# Altium schematic sheet HDMI.SchDoc
size A; SheetNumber: 8; SheetTotal: 10
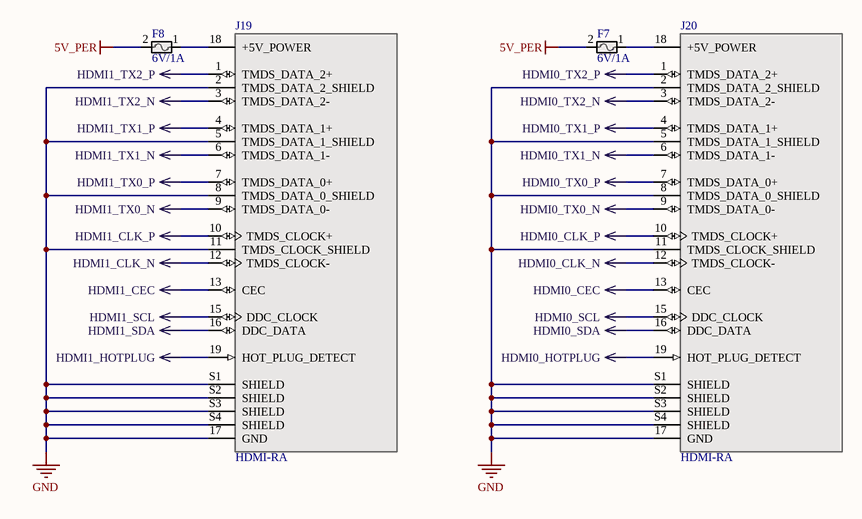
[diagram p0: HDMI.SchDoc]

## Parts
F7  6V/1A  [0805]
F8  6V/1A  [0805]
J19  HDMI-RA  [CUI_HD01-19-RA-TH]
J20  HDMI-RA  [CUI_HD01-19-RA-TH]

## Nets
5V_PER: F7.2 F8.2
GND: J19.2(TMDS_DATA_2_SHIELD) J19.5(TMDS_DATA_1_SHIELD) J19.8(TMDS_DATA_0_SHIELD) J19.11(TMDS_CLOCK_SHIELD) J19.17(GND) J19.S1(SHIELD) J19.S2(SHIELD) J19.S3(SHIELD) J19.S4(SHIELD) J20.2(TMDS_DATA_2_SHIELD) J20.5(TMDS_DATA_1_SHIELD) J20.8(TMDS_DATA_0_SHIELD) J20.11(TMDS_CLOCK_SHIELD) J20.17(GND) J20.S1(SHIELD) J20.S2(SHIELD) J20.S3(SHIELD) J20.S4(SHIELD)
HDMI0_CEC: J20.13(CEC)
HDMI0_CLK_N: J20.12(TMDS_CLOCK-)
HDMI0_CLK_P: J20.10(TMDS_CLOCK+)
HDMI0_HOTPLUG: J20.19(HOT_PLUG_DETECT)
HDMI0_SCL: J20.15(DDC_CLOCK)
HDMI0_SDA: J20.16(DDC_DATA)
HDMI0_TX0_N: J20.9(TMDS_DATA_0-)
HDMI0_TX0_P: J20.7(TMDS_DATA_0+)
HDMI0_TX1_N: J20.6(TMDS_DATA_1-)
HDMI0_TX1_P: J20.4(TMDS_DATA_1+)
HDMI0_TX2_N: J20.3(TMDS_DATA_2-)
HDMI0_TX2_P: J20.1(TMDS_DATA_2+)
HDMI1_CEC: J19.13(CEC)
HDMI1_CLK_N: J19.12(TMDS_CLOCK-)
HDMI1_CLK_P: J19.10(TMDS_CLOCK+)
HDMI1_HOTPLUG: J19.19(HOT_PLUG_DETECT)
HDMI1_SCL: J19.15(DDC_CLOCK)
HDMI1_SDA: J19.16(DDC_DATA)
HDMI1_TX0_N: J19.9(TMDS_DATA_0-)
HDMI1_TX0_P: J19.7(TMDS_DATA_0+)
HDMI1_TX1_N: J19.6(TMDS_DATA_1-)
HDMI1_TX1_P: J19.4(TMDS_DATA_1+)
HDMI1_TX2_N: J19.3(TMDS_DATA_2-)
HDMI1_TX2_P: J19.1(TMDS_DATA_2+)
NetF7_1: F7.1 J20.18(+5V_POWER)
NetF8_1: F8.1 J19.18(+5V_POWER)

## Notes on the sheet
- REV
- REVISIONS
- DATE
- DESCRIPTION
- BY
- UNLESS OTHERWISE SPECIFIED, DRAWING DEFINITIONS AND TOLERANCES SHALL BE FOUND UNDER SUPPLIER STANDARDS SS-001. THIS PART AND ALL COMPONENTS OF IT MUST BE RoHS & REACH COMPLIANT. A CERTIFICATE OF COMPLIANCE MUST BE PROVIDED UPON REQUEST.
- ALL INFORMATION ON THIS DOCUMENT IS THE SOLE PROPERTY OF GAMBER-JOHNSON AND SHALL NOT BE COPIED, REPRODUCED, USED OR DISCLOSED IN WHOLE OR IN PART WITHOUT THE WRITTEN CONSENT OF GAMBER-JOHNSON
- TOLERANCES
  .00 ± .060
  .000 ± .020
  .0000 ± .005
  ANGELS ± 1°
- DRAWN BY:
- PROJECT NUMBER:
- SHEET TITLE:
- SHEET
- OF
- DATE:
- LOCATION:
- ASSEMBLY NUMBER
- SIZE
- GAMBER-JOHNSON LLC
  5001 Joerns Dr
  STEVENS POINT, WI 54481
  +1 (715) 344-5209
- A

## Library data of the parts
F7 F8 = 0ZCK0100FF2E: Polymeric PTC Resettable Fuse 6V 1 A Ih Surface Mount 0805 (2012 Metric), Concave; Manufacturer: Bel; Max Current Rating: 40A; Hold Current: 1A; Trip Current: 1.95A; Time to Trip: 0.3s; Supplier 1: Digi-Key; Supplier Part Number 1: 507-1815-1-ND; Manufacturer Part Number: 0ZCK0100FF2E; RoHS: Yes; Category: PTC Resettable Fuses; Stock 1: 74738; Pricing 1: 1=0.27000, 5=0.26600, 10=0.25400, 50=0.22620, 100=0.21060, 250=0.18720, 500=0.15600, 1000=0.14820 (USD); Mount: Surface Mount; Case/Package: 0805; Case Code (Metric): 2012; Case Code (Imperial): 0805; Contact Plating: Tin,Matte; Min Operating Temperature: -40°C; Max Operating Temperature: 85°C; Package Quantity: 1; Packaging: Tape and Reel; RoHS Compliant: Yes; ComponentLink1URL: https://datasheet.ciiva.com/18550/0zck-18550620.pdf?src-supplier=Digi-Key; ComponentLink1Description: https://datasheet.ciiva.com/18550/0zck-18550620.pdf?src-supplier=Digi-Key; ComponentLink2URL: https://datasheet.ciiva.com/18550/0zck-18550621.pdf?src-supplier=Digi-Key; ComponentLink2Description: https://datasheet.ciiva.com/18550/0zck-18550621.pdf?src-supplier=Digi-Key; ComponentLink3URL: https://datasheet.ciiva.com/18550/0zck-18550622.pdf?src-supplier=Digi-Key; ComponentLink3Description: https://datasheet.ciiva.com/18550/0zck-18550622.pdf?src-supplier=Digi-Key; LCSC PN: C883112
J19 J20 = HD01-19-RA-TH: HDMI 2.1, Receptacle Connector, 19 Position, Through Hole, Vertical, Right Angle, Tray Packaging; MF: CUI Devices; Check_prices: https://www.snapeda.com/parts/HD01-19-RA-TH/CUI+Devices/view-part/?ref=eda; Digi-Key_Part_Number: 2223-HD01-19-RA-TH-ND; Value: *; CUI_purchase_URL: https://www.cuidevices.com/product/interconnect/connectors/hdmi-connectors/hd01-19-ra-th?utm_source=snapeda.com&utm_medium=referral&utm_campaign=snapedaBOM; SnapEDA_Link: https://www.snapeda.com/parts/HD01-19-RA-TH/CUI+Devices/view-part/?ref=snap; Package: None; MP: HD01-19-RA-TH; Purchase-URL: https://pricing.snapeda.com/search/part/HD01-19-RA-TH/?ref=eda; Supplier 1: Mouser; Supplier Part Number 1: 179-HD01-19-RA-TH; Supplier 2: Arrow Electronics; Supplier Part Number 2: 2007435-1; LCSC PN: C2836126